# Altium schematic sheet treehopper-micro.SchDoc
size Letter; Organization: Altium Limited; Address1: L3, 12a Rodborough Rd; Address2: Frenchs Forest; Address3: NSW; Address4: Australia 2086; DocumentNumber: 4; Revision: 1; SheetNumber: 1; SheetTotal: 3
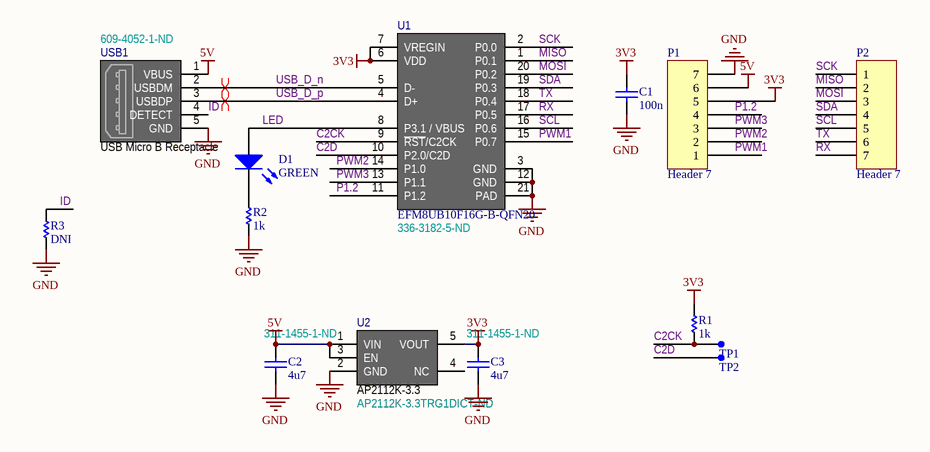
[diagram p0: treehopper-micro.SchDoc]

## Parts
C1  100n  [CAPC1005N]
C2  4u7  Supplier Part Number 1: 311-1455-1-ND  [CAPC1608N]
C3  4u7  Supplier Part Number 1: 311-1455-1-ND  [CAPC1608N]
D1  GREEN  [LTST-C190GKT_NO_SILK]
P1  Header 7  [HDR1X7_CASTELATED]
P2  Header 7  [HDR1X7_CASTELATED]
R1  1k  [RESC1005N]
R2  1k  [RESC1005N]
R3  DNI  [RESC1005N_TIE]  (net tie, no BOM)
TP1  TESTPOINT  [TESTPOINT100]  (value not drawn)  (no BOM)
TP2  TESTPOINT  [TESTPOINT100]  (value not drawn)  (no BOM)
U1  EFM8UB10F16G-B-QFN20  Supplier Part Number 1: 336-3182-5-ND  [QFN50P300X300X90-20N]
U2  AP2112K-3.3  Supplier Part Number 1: AP2112K-3.3TRG1DICT-ND  [SOT23-5AN-no-silk]
USB1  USB Micro B Receptacle  Supplier Part Number 1: 609-4052-1-ND  [ZX60-B-5S(01)]

## Nets
3V3: C1.2 C3.2 P1.5 R1.2 U1.6(VDD) U1.7(VREGIN) U2.5(VOUT)
5V: C2.2 P1.6 U2.1(VIN) U2.3(EN) USB1.1(VBUS)
GND: C1.1 C2.1 C3.1 P1.7 R2.1 R3.1 U1.3(GND) U1.12(GND) U1.21(PAD) U2.2(GND) USB1.5(GND)
C2CK: R1.1 TP1.1(TP) U1.9(~{RST}/C2CK)
C2D: TP2.1(TP) U1.10(P2.0/C2D)
ID: R3.2 USB1.4(DETECT)
LED: D1.1(A) U1.8(P3.1_/_VBUS)
MISO: P2.2 U1.1(P0.1)
MOSI: P2.3 U1.20(P0.2)
P1.2: P1.4 U1.11(P1.2)
PWM1: P1.1 U1.15(P0.7)
PWM2: P1.2 U1.14(P1.0)
PWM3: P1.3 U1.13(P1.1)
RX: P2.7 U1.17(P0.5)
SCK: P2.1 U1.2(P0.0)
SCL: P2.5 U1.16(P0.6)
SDA: P2.4 U1.19(P0.3)
TX: P2.6 U1.18(P0.4)
USB_D_n: U1.5(D-) USB1.2(USBDM)
USB_D_p: U1.4(D+) USB1.3(USBDP)
NetD1_2: D1.2(K) R2.2

Not connected (* = marked no-connect by the designer): U2 4(NC)

## Layout directives
differential pair: USB_D_n, USB_D_p

## Notes on the sheet
- Revision
- Project:
- Sheet
- of
- Jay Carlson
  209N SEC
  P.O. Box 880511
  Lincoln, NE 68588-0511
- B

## Library data of the parts
C1 = Cap Semi: Capacitor (Semiconductor SIM Model); Published: 8-Jun-2000; LatestRevisionDate: 29-May-2009; LatestRevisionNote: IPC-7351 Footprint Added.; PackageReference: C1206; Publisher: Altium Limited; PackageDescription: Chip Capacitor
C2 C3 = Cap Semi: CAP SEMI 4U7 10V 0603; Published: 8-Jun-2000; LatestRevisionDate: 29-May-2009; LatestRevisionNote: IPC-7351 Footprint Added.; PackageReference: C1206; Publisher: Altium Limited; PackageDescription: Chip Capacitor; Supplier 1: Digi-Key
D1 = LED_GREEN: Typical greenGaAs LED; Published: 8-Jun-2000; LatestRevisionDate: 17-Jul-2002; LatestRevisionNote: Re-released for DXP Platform.; PackageVersion: Feb-2002; PackageReference: 3.2X1.6X1.1; Publisher: Altium Limited; PackageDescription: SM LED; 2 Flat Leads
P1 P2 = Header 7: Header, 7-Pin; LatestRevisionDate: 17-Jul-2002; LatestRevisionNote: Re-released for DXP Platform.; Publisher: Altium Limited
R1-R3 = Res Semi: Semiconductor Resistor; Published: 8-Jun-2000; LatestRevisionDate: 17-Jul-2002; LatestRevisionNote: Re-released for DXP Platform.; PackageReference: AXIAL-0.5; Publisher: Altium Limited; PackageDescription: Axial Device, Thru-Hole; 2 Leads; 0.5 in Pin Spacing
U1 = EFM8UB10F16G-B-QFN20: IC MCU 16KB 20QFN; Manufacturer: Silicon Labs; Core Size: 8-Bit; Speed: 50MHz; Connectivity: I²C, SMBus, SPI, UART/USART, USB; Peripherals: Brown-out Detect/Reset, POR, PWM, WDT; Number of I/O: 13; Program Memory Size: 16KB (16K x 8); Program Memory Type: FLASH; RAM Size: 2.25K x 8; Voltage - Supply (Vcc/Vdd): 2.2 V ~ 5.25 V; Data Converters: A/D 11x12b; Oscillator Type: Internal; Supplier 1: Digi-Key; Manufacturer Part Number: EFM8UB10F16G-B-QFN20; RoHS: RoHS Compliant; Category: Integrated Circuits (ICs); Stock 1: 75; Pricing 1: 1=1.18, 25=1.0832, 100=0.9848, 1000=0.88628 (USD); Packaging: Tube; Core Processor: CIP-51 8051; EEPROM Size: -; Operating Temperature: -40°C ~ 85°C; Package / Case: 20-UFQFN Exposed Pad; Supplier Device Package: 20-QFN (3x3); ComponentLink1URL: http://www.silabs.com/Support%20Documents/TechnicalDocs/EFM8UB1_DataSheet.pdf; ComponentLink1Description: http://www.silabs.com/Support%20Documents/TechnicalDocs/EFM8UB1_DataSheet.pdf
U2 = AP2112K-3.3: AP2112 IC REG LDO 3.3V 0.6A SOT25; Manufacturer: Diodes Incorporated; Manufacturer Part Number: AP2112K-3.3TRG1; Regulator Topology: Positive Fixed; Current - Output: 600mA; Voltage - Dropout (Typical): 0.25V @ 600mA; Number of Regulators: 1; Voltage - Input: Up to 6V; Supplier 1: Digi-Key; RoHS: RoHS Compliant; Category: Integrated Circuits (ICs); Stock 1: 13320; Pricing 1: 1=0.56, 10=0.397, 25=0.3264, 100=0.2609, 250=0.19008, 500=0.15436, 1000=0.11866 (USD); Packaging: Cut Tape (CT); Voltage - Output: 3.3V; Current - Limit (Min): -; Operating Temperature: -40°C ~ 85°C; Mounting Type: Surface Mount; Package / Case: SC-74A, SOT-753; Supplier Device Package: SOT-23-5; ComponentLink1URL: http://www.diodes.com/datasheets/AP2112.pdf; ComponentLink1Description: http://www.diodes.com/datasheets/AP2112.pdf
TP1 TP2 = TESTPOINT: LatestRevisionDate: 17-Jul-2002; LatestRevisionNote: Re-released for DXP Platform.; Publisher: Altium Limited
USB1 = USB Micro B Receptacle: Supplier 1: Digi-Key